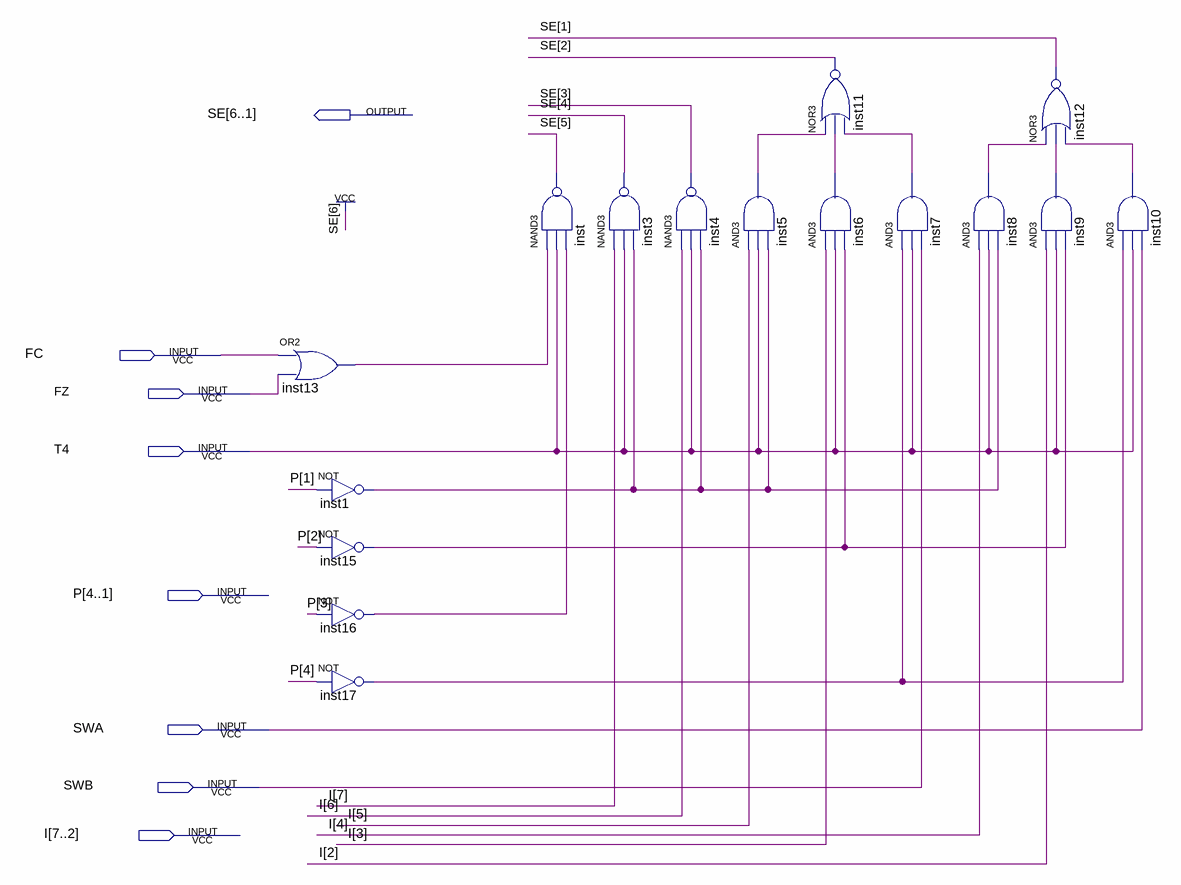
[diagram p0: schematic sheet]
// Quartus schematic CmotDemo.bdf as structural Verilog: 16 symbols, 8 pins
module CmotDemo (
  input  FC,
  input  FZ,
  input  T4,
  input  [4:1] P,
  input  SWA,
  input  SWB,
  input  [7:2] I,
  output [6:1] SE
);

  wire inst1_out, inst5_out, inst6_out, inst7_out, inst8_out, inst9_out, inst10_out, inst13_out, inst15_out,
       inst16_out, inst17_out;

  or inst13 (inst13_out, FC, FZ);
  not inst1 (inst1_out, P[1]);
  not inst15 (inst15_out, P[2]);
  not inst16 (inst16_out, P[3]);
  not inst17 (inst17_out, P[4]);
  nand inst (SE[5], inst13_out, T4, inst16_out);
  nand inst3 (SE[4], I[7], T4, inst1_out);
  nand inst4 (SE[3], I[6], T4, inst1_out);
  and inst5 (inst5_out, I[5], T4, inst1_out);
  nor inst11 (SE[2], inst5_out, inst6_out, inst7_out);
  and inst6 (inst6_out, I[3], T4, inst15_out);
  and inst7 (inst7_out, inst17_out, T4, SWB);
  and inst8 (inst8_out, I[4], T4, inst1_out);
  nor inst12 (SE[1], inst8_out, inst9_out, inst10_out);
  and inst9 (inst9_out, I[2], T4, inst15_out);
  and inst10 (inst10_out, inst17_out, T4, SWA);

  assign SE[6] = 1'b1;
endmodule
